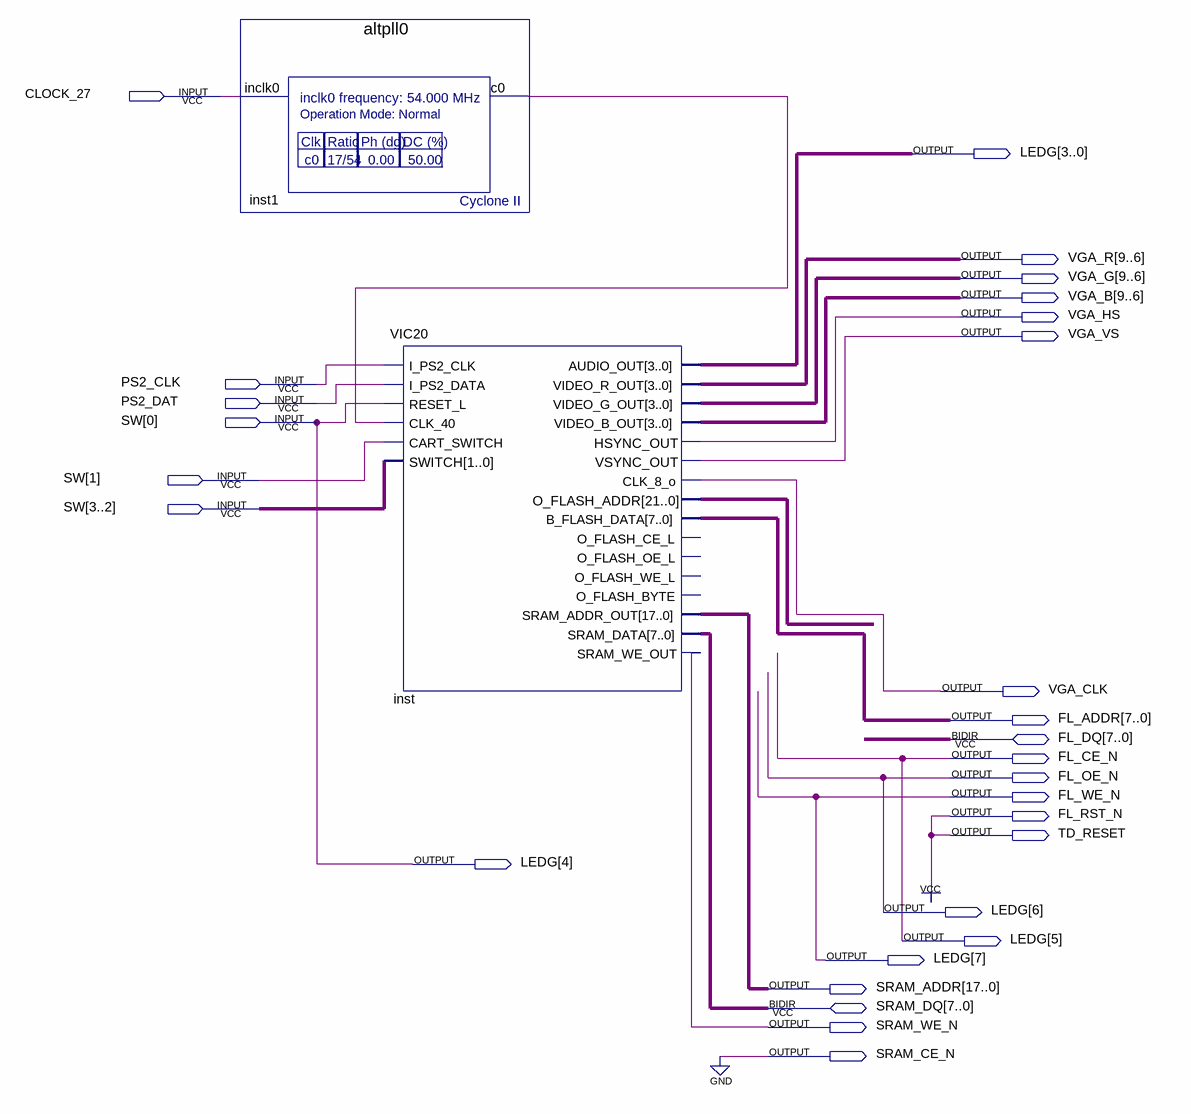
[diagram p0: schematic sheet]
// Quartus schematic toplevel.bdf as structural Verilog: 2 symbols, 28 pins
module toplevel (
  input  CLOCK_27,
  input  PS2_CLK,
  input  PS2_DAT,
  input  [3:0] SW,
  inout  [7:0] FL_DQ,
  inout  [7:0] SRAM_DQ,
  output [7:0] LEDG,
  output [9:6] VGA_R,
  output [9:6] VGA_G,
  output [9:6] VGA_B,
  output VGA_HS,
  output VGA_VS,
  output VGA_CLK,
  output [7:0] FL_ADDR,
  output FL_CE_N,
  output FL_OE_N,
  output FL_WE_N,
  output FL_RST_N,
  output TD_RESET,
  output [17:0] SRAM_ADDR,
  output SRAM_WE_N,
  output SRAM_CE_N
);

  wire inst1_c0;
  wire [21:0] inst_o_flash_addr;

  altpll0 inst1 (.inclk0(CLOCK_27), .c0(inst1_c0));
  VIC20 inst (
    .I_PS2_CLK(PS2_CLK), .I_PS2_DATA(PS2_DAT), .RESET_L(SW[0]), .CLK_40(inst1_c0), .CART_SWITCH(SW[1]),
    .SWITCH(SW[3:2]), .AUDIO_OUT(LEDG[3:0]), .VIDEO_R_OUT(VGA_R), .VIDEO_G_OUT(VGA_G), .VIDEO_B_OUT(VGA_B),
    .HSYNC_OUT(VGA_HS), .VSYNC_OUT(VGA_VS), .CLK_8_o(VGA_CLK), .O_FLASH_ADDR(inst_o_flash_addr),
    .SRAM_ADDR_OUT(SRAM_ADDR), .SRAM_WE_OUT(SRAM_WE_N), .B_FLASH_DATA(FL_ADDR), .SRAM_DATA(SRAM_DQ));  // open: O_FLASH_CE_L, O_FLASH_OE_L, O_FLASH_WE_L, O_FLASH_BYTE

  assign FL_RST_N = 1'b1;
  assign LEDG[7:4] = {FL_WE_N, FL_OE_N, FL_CE_N, SW[0]};
  assign SRAM_CE_N = 1'b0;
  assign TD_RESET = 1'b1;
endmodule
